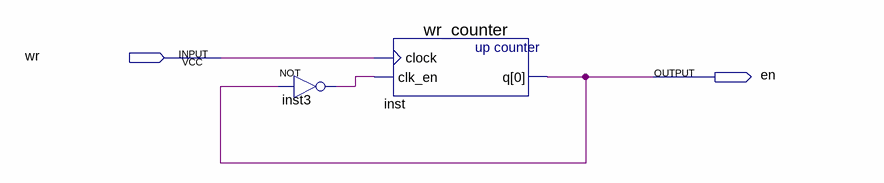
[diagram p0: schematic sheet]
// Quartus schematic write_counter.bdf as structural Verilog: 2 symbols, 2 pins
module write_counter (
  input  wr,
  output en
);

  wire inst3_out;

  not inst3 (inst3_out, en);
  wr_counter inst (.clock(wr), .clk_en(inst3_out), .q(en));
endmodule
